# EAGLE design radio (EAGLE 9.6.2)
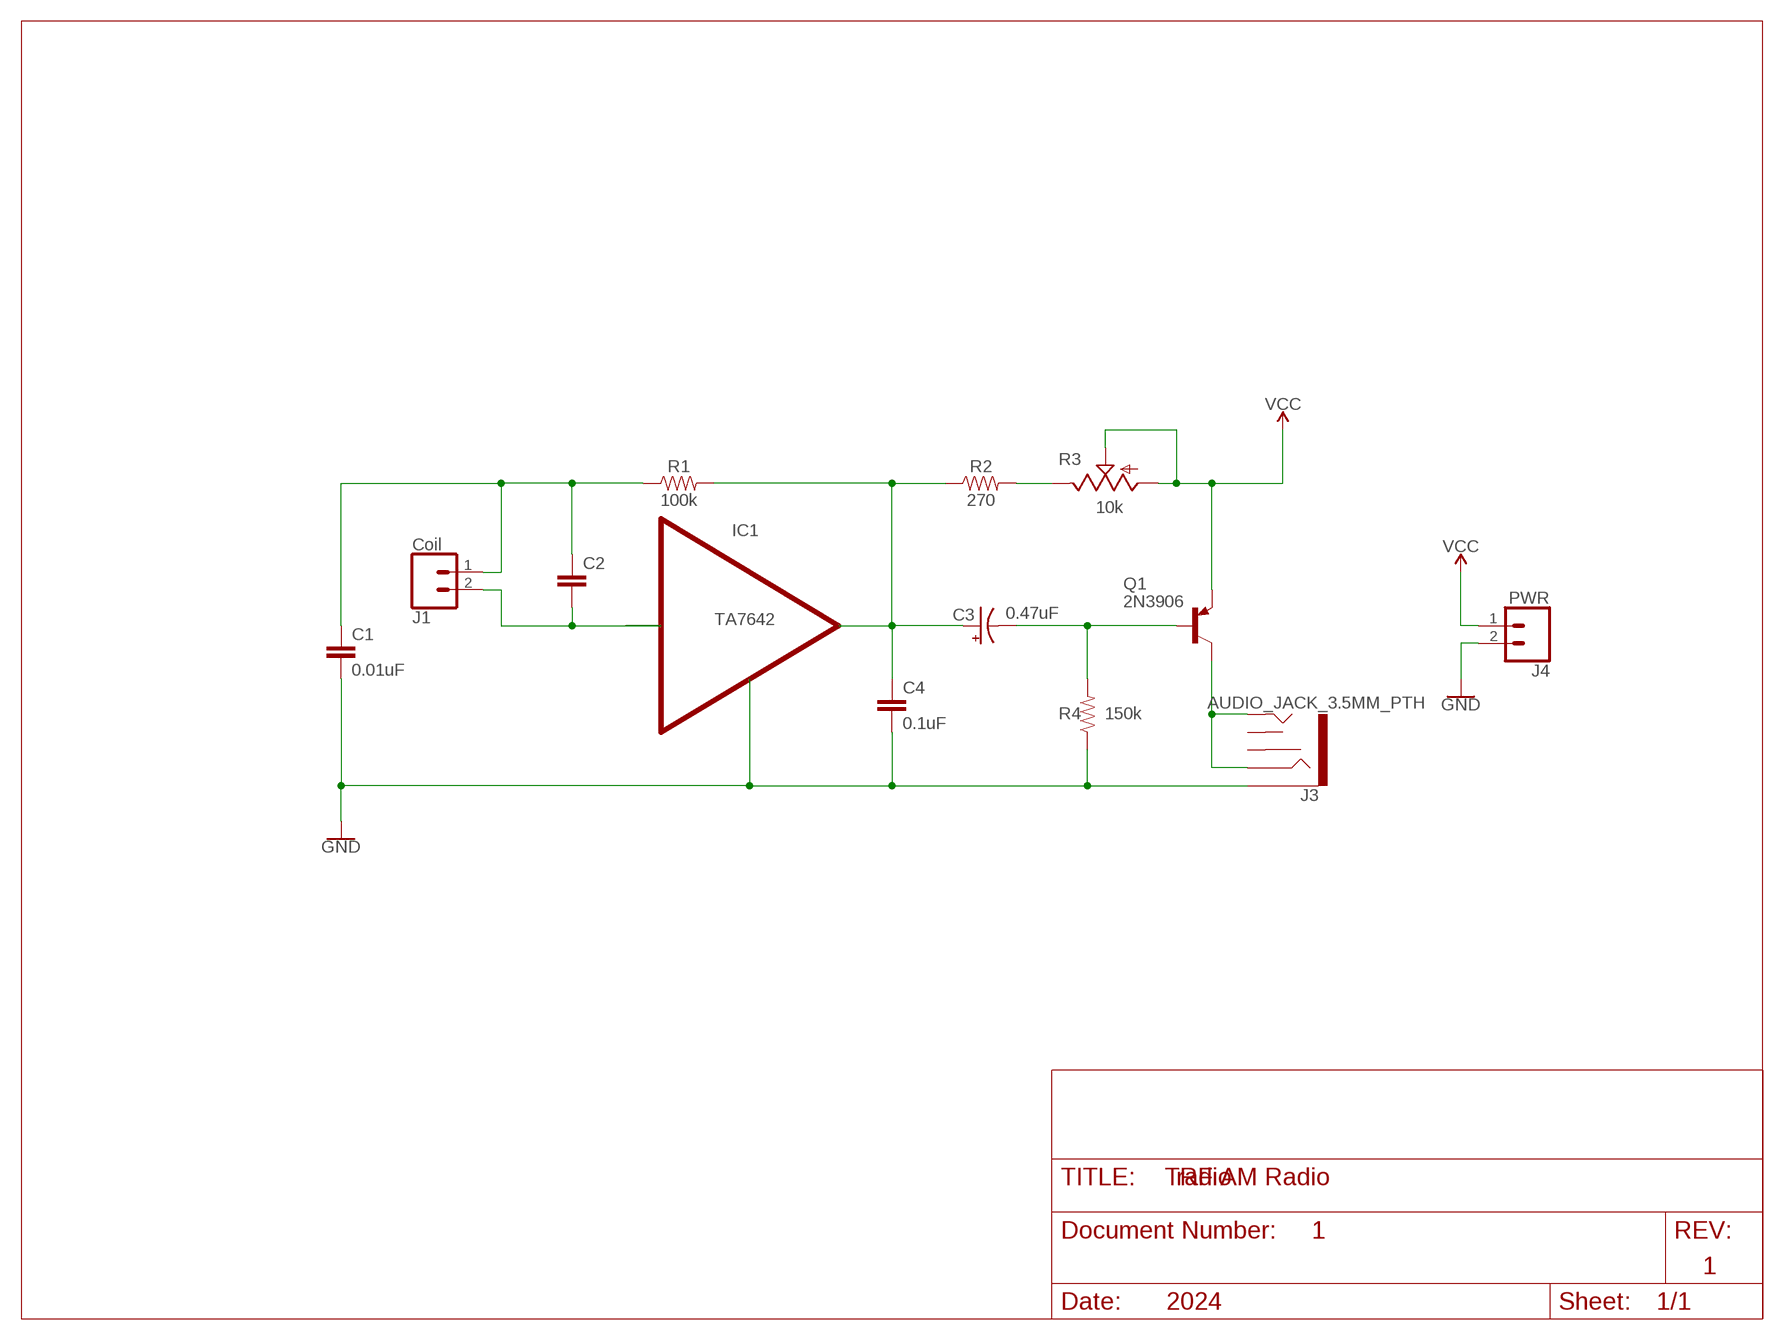
[diagram p0: schematic, sheet 1]

## Parts
C1  0.01uF  22PF-PTH-2.54MM-200V-5%  [CAP-PTH-2.54]
C2  22PF-PTH-2.54MM-200V-5%  [CAP-PTH-2.54]
C3  0.47uF  10UF-POLAR-RADIAL-2.5MM-25V-20%  [CPOL-RADIAL-2.5MM-5MM]
C4  0.1uF  22PF-PTH-2.54MM-200V-5%  [CAP-PTH-2.54]
IC1  TA7642  [TO92]
J1  Coil  CONN_02  [1X02]
J3  AUDIO_JACK_3.5MM_PTH  [AUDIO-JACK]
J4  PWR  CONN_02  [1X02]
Q1  2N3906  [TO92]
R1  100k  RESISTORAXIAL-0.3  [AXIAL-0.3]
R2  270  RESISTORAXIAL-0.3  [AXIAL-0.3]
R3  10k  TRIM_US-B25P  [B25P]
R4  150k  RESISTORAXIAL-0.3  [AXIAL-0.3]

## Nets
GND: C1.2 C4.2 IC1.2(GND) J3.SLEEVE J4.2 R4.P$1
N$1: J3.RING J3.TIP Q1.1(C)
N$2: C3.1(+) C4.1 IC1.1(OUT) R1.P$2 R2.P$1
N$3: C1.1 C2.1 J1.1 R1.P$1
N$4: R2.P$2 R3.E
N$5: C3.2(-) Q1.2(B) R4.P$2
N$7: C2.2 IC1.3(INPUT) J1.2
VCC: J4.1 Q1.3(E) R3.A R3.S
Unconnected: J3.RSH J3.TSH

## Notes on the sheet
- TRF AM Radio
- 1
- 1
- 2024

## Library data of the parts
C1 C2 C4 = SparkFun-Capacitors:22PF: 22pF ceramic capacitors A capacitor is a passive two-terminal electrical component used to store electrical energy temporarily in an electric field.; PROD_ID: CAP-09128; VALUE: 22pF
C3 = SparkFun-Capacitors:10UF-POLAR: 10.0µF polarized capacitors A capacitor is a passive two-terminal electrical component used to store electrical energy temporarily in an electric field.; PROD_ID: CAP-08440; VALUE: 10uF
IC1 = MyParts:TA7642
J1 J4 = SparkFun-Connectors:CONN_02: Multi connection point. Often used as Generic Header-pin footprint for 0.1 inch spaced/style header connections On any of the 0.1 inch spaced packages, you can populate with these: Break Away Headers - Straight <https://www.sparkfun.com/products/116> (PRT-00116) Break Away Male Headers - Right Angle <https://www.sparkfun.com/products/553> (PRT-00553) Female Headers <https://www.sparkfun.com/products/115> (PRT-00115) Break Away Headers - Machine Pin <https://www.sparkfun.com/products/117> (PRT-00117) Break Away Female Headers - Swiss Machine Pin <https://www.sparkfun.com/products/743> (PRT-00743) For SCREWTERMINALS and SPRING TERMINALS visit here: Screw Terimnals on SparkFun.com <https://www.sparkfun.com/search/results?term=Screw+Terminals> (5mm/3.5mm/2.54mm spacing) This device is also useful as a general connection point to wire up your design to another part of your project. Our various solder wires solder well into these plated through hole pads. Hook-Up Wire - Assortment (Stranded, 22 AWG) <https://www.sparkfun.com/products/11375> (PRT-11375) Hook-Up Wire - Assortment (Solid Core, 22 AWG) <https://www.sparkfun.com/products/11367> (PRT-11367) View the entire wire category on our website here <https://www.sparkfun.com/categories/141> Special notes: Molex polarized connector foot print use with: PRT-08233 with associated crimp pins and housings. 2.54_SCREWTERM for use with PRT-10571. 3.5mm Screw Terminal footprints for PRT-08084 5mm Screw Terminal footprints for use with PRT-08432
J3 = SparkFun-Connectors:AUDIO_JACK_3.5MM: Audio Jack 3.5mm variants of PTH and SMT stereo audio jack with bypass switches. SparkFun Products: SparkFun SparkPunk Sound Kit <[https://www.sparkfun.com/products/11177]> - PTH MP3 Trigger <https://www.sparkfun.com/products/13720> -3.5mm SMD SparkFun PicoBoard <https://www.sparkfun.com/products/11888>- 2.5mm SMD; PROD_ID: CONN-08774; SF_ID: PRT-08032
Q1 = transistor-pnp:2N3906: PNP Transistor
R1 R2 R4 = SparkFun-Resistors:RESISTOR: Generic Resistor Package
R3 = pot:TRIM_US-: POTENTIOMETER

## Net classes
0 default: width 0.254 mm
1 power: width 0.508 mm

## Board
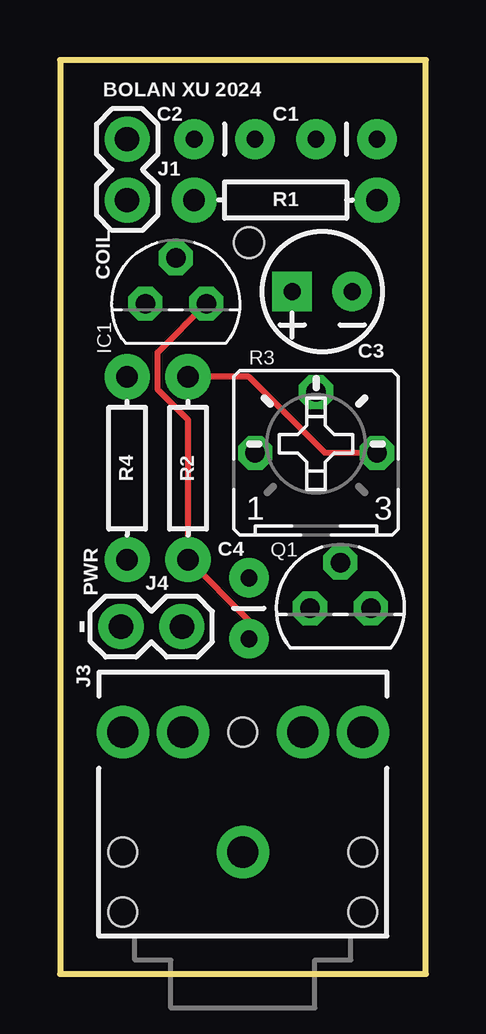
[diagram p1: board, top side]
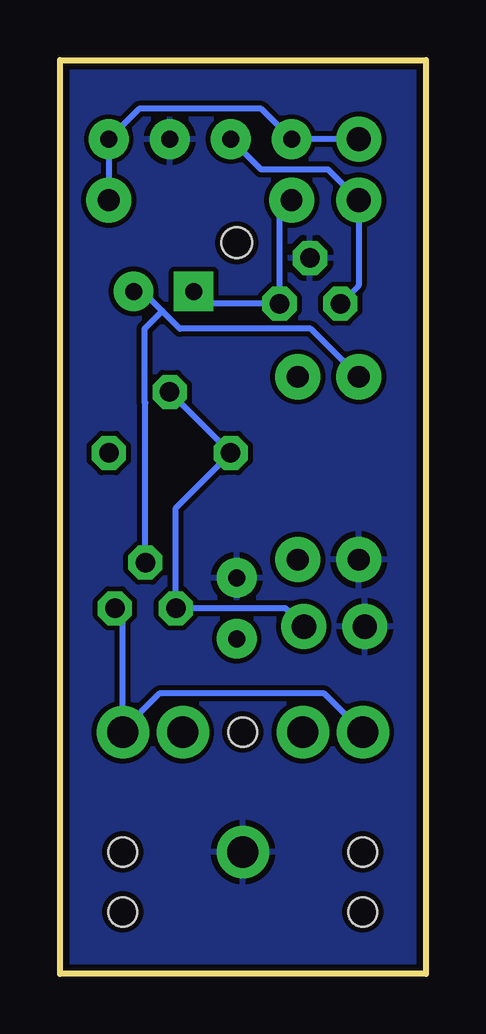
[diagram p2: board, bottom side, seen from below]

Size 15.24 x 38.1 mm. Coordinates in mm from the lower left corner, seen from the top.
Outline: 0,38.1 0,0 15.24,0 15.24,38.1 0,38.1
Copper layers (1*16): Top 0.035mm / dielectric 1.5mm / Bottom 0.035mm
Design rules "SparkFun": minimum track width 8mil, minimum drill 20mil, track to track 8mil, track to pad 8mil, pad to pad 8mil, via to via 8mil, smd to smd 8mil, copper to edge 10mil, drill to drill 8mil, minimum pad ring 12mil, minimum via ring 10mil, stop-mask expansion 4mil, vias tented up to drill 25mil, thermal gap 10mil
Holes 1.27 mm at 7.87,30.48

### Footprints (pad centres in the part's own frame; a part is rotated, then mirrored left to right if it is on the bottom)
CAP-PTH-2.54 = drill 0.7 pad 1.651: 1 -1.27,0; 2 1.27,0
CPOL-RADIAL-2.5MM-5MM = drill 0.7 pad 1.651 square: 1 1.25,0 | drill 0.7 pad 1.651: 2 -1.25,0
TO92 = drill 0.813 octagon: 1 1.27,0; 2 0,1.905; 3 -1.27,0
1X02 = drill 1.016 pad 1.88: 1 0,0; 2 2.54,0
AUDIO-JACK = drill 1.3 pad 2.184: RING 5,5; RSH 5,2.5; SLEEVE 0,0; TIP 5,-5; TSH 5,-2.5 | hole 1.2: 0,5; -2.5,5; -2.5,-5; 0,-5; 5,0
AXIAL-0.3 = drill 0.9 pad 1.88: P$1 -3.81,0; P$2 3.81,0
B25P = drill 0.813 octagon: A -2.54,0; E 2.54,0; S 0,2.54

### Placement (x,y rotation side)
C1  11.94,34.8 180 top
C2  6.86,34.8 0 top
C3  10.92,28.45 180 top
C4  7.87,15.24 90 top
IC1  4.83,27.94 0 top
J1  2.79,34.8 270 top
J3  7.62,5.08 90 top
J4  5.08,14.48 180 top
Q1  11.68,15.24 0 top
R1  9.4,32.26 180 top
R2  5.33,21.08 90 top
R3  10.67,21.72 0 top
R4  2.79,21.08 90 top

### Tracks (layer width: path | path; a pad name or v marks a point on that pad's centre or on a via)
GND
  pour Bottom: 0.25,37.85 14.99,37.85 14.99,0.25 0.25,0.25
N$1
  Bottom 0.254: J3.TIP 12.62,10.16 | 12.62,10.16 12.62,14.91 Q1.1 | J3.RING 4.22,11.68 11.1,11.68 12.62,10.16
N$2
  Top 0.254: C4.1 7.87,14.73 R2.P$1 5.33,23.1 4.06,24.37 4.06,25.91 IC1.1
  Bottom 0.254: R1.P$2 6.1,31.75 IC1.1 9.16,27.94 C3.1
N$3
  Bottom 0.254: J1.1 C2.1 6.86,36.07 11.94,36.07 C1.1 R1.P$1
N$4
  Top 0.254: R3.E 11.05,21.72 7.87,24.89 R2.P$2
N$5
  Bottom 0.254: R4.P$2 4.8,26.9 10.24,26.9 10.97,27.63 | C3.2 11.79,28.45 10.97,27.63 | Q1.2 11.68,23.8 11.71,23.83 11.71,26.9 10.97,27.63
N$7
  Bottom 0.254: C2.2 6.86,33.53 4.06,33.53 J1.2 2.79,28.7 IC1.3
VCC
  Bottom 0.254: R3.S R3.A 10.41,19.43 Q1.3 5.84,15.24 J4.1

### Text on the board
tPlace: BOLAN XU 2024 | COIL | PWR | -